# Altium schematic sheet Sheet1.SchDoc
size 330 x 215 mm
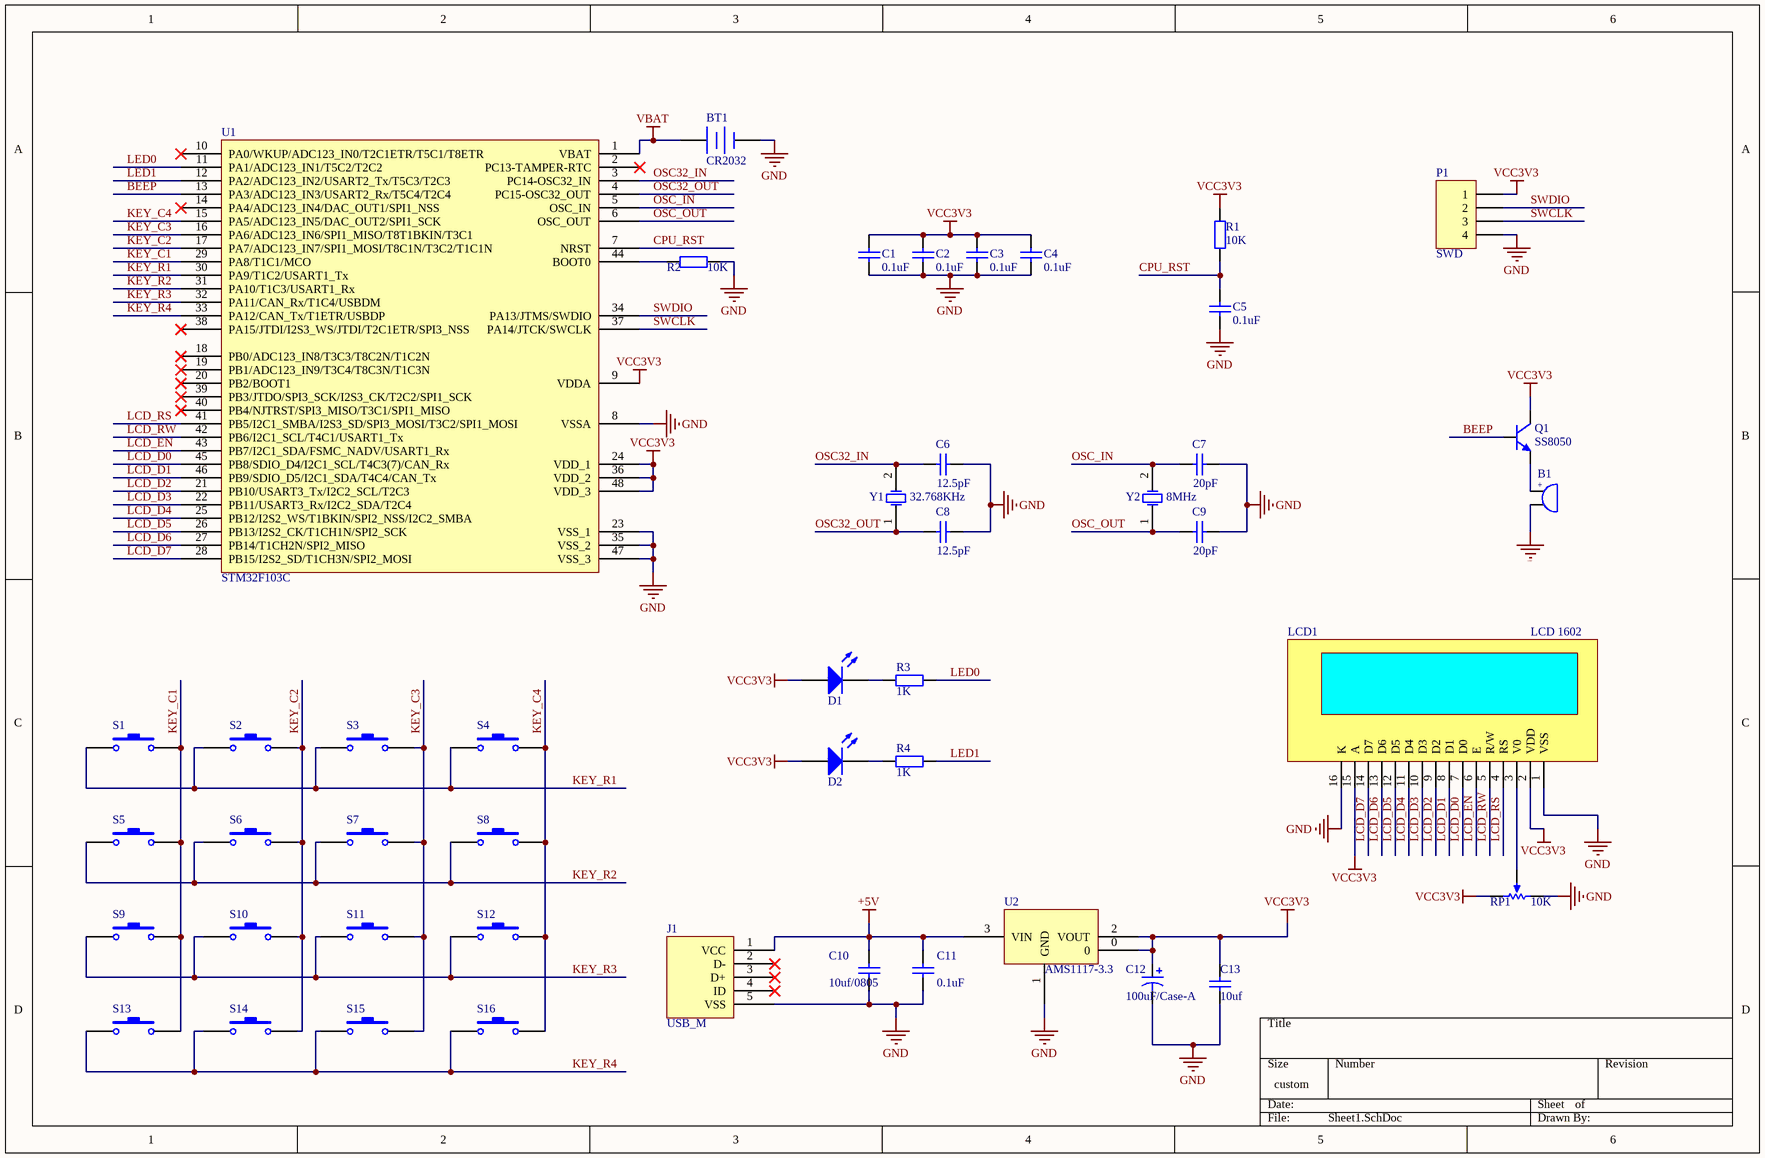
[diagram p0: Sheet1.SchDoc]

## Parts
B1  (no value)  [Beep]
BT1  CR2032  [CR1220]
C1  0.1uF  [C-RAD-0805]
C2  0.1uF  [C-RAD-0805]
C3  0.1uF  [C-RAD-0805]
C4  0.1uF  [C-RAD-0805]
C5  0.1uF  [C-RAD-0805]
C6  12.5pF  [C-RAD-0805]
C7  20pF  [C-RAD-0805]
C8  12.5pF  [C-RAD-0805]
C9  20pF  [C-RAD-0805]
C10  value 10uf/0805  [C-RAD-0805]  (hidden comment: Cap)
C11  value 0.1uF  [C-RAD-0805]  (hidden comment: Cap)
C12  value 100uF/Case-A  [CAP-3216]  (hidden comment: Cap Pol3)
C13  value 10uf  [C-RAD-0805]  (hidden comment: Cap)
D1  LED0  [LED_A2]  (value not drawn)
D2  LED0  [LED_A2]  (value not drawn)
J1  USB_M  [USB_MICRO]
LCD1  LCD 1602  [LCD-1602-ok]
P1  SWD  [HDR1X4]
Q1  SS8050  [SOT-23]
R1  10K  [0805-1]
R2  10K  [0805-1]
R3  1K  [0805-1]
R4  1K  [0805-1]
RP1  value 10K  [VR_A1]  (hidden comment: RPot)
S1  (no value)  [SW_PB2_A1]
S2  (no value)  [SW_PB2_A1]
S3  (no value)  [SW_PB2_A1]
S4  (no value)  [SW_PB2_A1]
S5  (no value)  [SW_PB2_A1]
S6  (no value)  [SW_PB2_A1]
S7  (no value)  [SW_PB2_A1]
S8  (no value)  [SW_PB2_A1]
S9  (no value)  [SW_PB2_A1]
S10  (no value)  [SW_PB2_A1]
S11  (no value)  [SW_PB2_A1]
S12  (no value)  [SW_PB2_A1]
S13  (no value)  [SW_PB2_A1]
S14  (no value)  [SW_PB2_A1]
S15  (no value)  [SW_PB2_A1]
S16  (no value)  [SW_PB2_A1]
U1  STM32F103C  [LQFP-48_M]
U2  AMS1117-3.3  [SOT-223]
Y1  32.768KHz  [X-TC15]
Y2  8MHz  [X-HC49U]

## Nets
+5V: C10.2 C11.2 J1.1(VCC) U2.3(VIN)
GND: B1.2 BT1.2(-) C1.2 C2.2 C3.2 C4.2 C5.1 C6.2 C7.2 C8.2 C9.2 C10.1 C11.1 C12.2 C13.1 J1.5(VSS) LCD1.1(VSS) LCD1.16(K) P1.4 R2.2 RP1.1(TOP) U1.8(VSSA) U1.23(VSS_1) U1.35(VSS_2) U1.47(VSS_3) U2.1(GND)
VBAT: BT1.1(+) U1.1(VBAT)
VCC3V3: C1.1 C2.1 C3.1 C4.1 C12.1 C13.2 D1.1(A) D2.1(A) LCD1.2(VDD) LCD1.15(A) P1.1 Q1.3(C) R1.1 RP1.3(BOT) U1.9(VDDA) U1.24(VDD_1) U1.36(VDD_2) U1.48(VDD_3) U2.0 U2.2(VOUT)
BEEP: Q1.2(B) U1.13(PA3/ADC123_IN3/USART2_Rx/T5C4/T2C4)
CPU_RST: C5.2 R1.2 U1.7(NRST)
KEY_C1: S1.2 S5.2 S9.2 S13.2 U1.29(PA8/T1C1/MCO)
KEY_C2: S2.2 S6.2 S10.2 S14.2 U1.17(PA7/ADC123_IN7/SPI1_MOSI/T8C1N/T3C2/T1C1N)
KEY_C3: S3.2 S7.2 S11.2 S15.2 U1.16(PA6/ADC123_IN6/SPI1_MISO/T8T1BKIN/T3C1)
KEY_C4: S4.2 S8.2 S12.2 S16.2 U1.15(PA5/ADC123_IN5/DAC_OUT2/SPI1_SCK)
KEY_R1: S1.1 S2.1 S3.1 S4.1 U1.30(PA9/T1C2/USART1_Tx)
KEY_R2: S5.1 S6.1 S7.1 S8.1 U1.31(PA10/T1C3/USART1_Rx)
KEY_R3: S9.1 S10.1 S11.1 S12.1 U1.32(PA11/CAN_Rx/T1C4/USBDM)
KEY_R4: S13.1 S14.1 S15.1 S16.1 U1.33(PA12/CAN_Tx/T1ETR/USBDP)
LCD_D0: LCD1.7(D0) U1.45(PB8/SDIO_D4/I2C1_SCL/T4C3(7)/CAN_Rx)
LCD_D1: LCD1.8(D1) U1.46(PB9/SDIO_D5/I2C1_SDA/T4C4/CAN_Tx)
LCD_D2: LCD1.9(D2) U1.21(PB10/USART3_Tx/I2C2_SCL/T2C3)
LCD_D3: LCD1.10(D3) U1.22(PB11/USART3_Rx/I2C2_SDA/T2C4)
LCD_D4: LCD1.11(D4) U1.25(PB12/I2S2_WS/T1BKIN/SPI2_NSS/I2C2_SMBA)
LCD_D5: LCD1.12(D5) U1.26(PB13/I2S2_CK/T1CH1N/SPI2_SCK)
LCD_D6: LCD1.13(D6) U1.27(PB14/T1CH2N/SPI2_MISO)
LCD_D7: LCD1.14(D7) U1.28(PB15/I2S2_SD/T1CH3N/SPI2_MOSI)
LCD_EN: LCD1.6(E) U1.43(PB7/I2C1_SDA/FSMC_NADV/USART1_Rx)
LCD_RS: LCD1.4(RS) U1.41(PB5/I2C1_SMBA/I2S3_SD/SPI3_MOSI/T3C2/SPI1_MOSI)
LCD_RW: LCD1.5(R/W) U1.42(PB6/I2C1_SCL/T4C1/USART1_Tx)
LED0: R3.1 U1.11(PA1/ADC123_IN1/T5C2/T2C2)
LED1: R4.1 U1.12(PA2/ADC123_IN2/USART2_Tx/T5C3/T2C3)
OSC32_IN: C6.1 U1.3(PC14-OSC32_IN) Y1.2(OSC2)
OSC32_OUT: C8.1 U1.4(PC15-OSC32_OUT) Y1.1(OSC1)
OSC_IN: C7.1 U1.5(OSC_IN) Y2.2(OSC2)
OSC_OUT: C9.1 U1.6(OSC_OUT) Y2.1(OSC1)
SWCLK: P1.3 U1.37(PA14/JTCK/SWCLK)
SWDIO: P1.2 U1.34(PA13/JTMS/SWDIO)
NetB1_1: B1.1 Q1.1(E)
NetD1_2: D1.2(K) R3.2
NetD2_2: D2.2(K) R4.2
NetLCD1_3: LCD1.3(V0) RP1.2(TAP)
NetR2_1: R2.1 U1.44(BOOT0)

Not connected (* = marked no-connect by the designer): J1 2(D-)* 3(D+)* 4(ID)*; U1 2(PC13-TAMPER-RTC)* 10(PA0/WKUP/ADC123_IN0/T2C1ETR/T5C1/T8ETR)* 14(PA4/ADC123_IN4/DAC_OUT1/SPI1_NSS)* 18(PB0/ADC123_IN8/T3C3/T8C2N/T1C2N)* 19(PB1/ADC123_IN9/T3C4/T8C3N/T1C3N)* 20(PB2/BOOT1)* 38(PA15/JTDI/I2S3_WS/JTDI/T2C1ETR/SPI3_NSS)* 39(PB3/JTDO/SPI3_SCK/I2S3_CK/T2C2/SPI1_SCK)* 40(PB4/NJTRST/SPI3_MISO/T3C1/SPI1_MISO)*

## Notes on the sheet
- (in symbol BEEP) +

## Library data of the parts
B1 = BEEP: 蜂鸣器; 版权归属: 源创客; BOM名称: 蜂鸣器; 学习资源: www.ooocke.com
BT1 = Battery: 备份电池; Published: 24-Mar-1999; LatestRevisionDate: 17-Jul-2002; LatestRevisionNote: Re-released for DXP Platform.; PackageReference: BAT-2; Publisher: Altium Limited
C1-C4 = CAP: Capacitor; Value: 100nF; Published: 8-Jun-2000; Revision: July-2002: Re-released for DXP Platform.; Publisher: Altium Limited
C5-C9 = Cap: 无极性电容; Value: 100nF; Published: 8-Jun-2000; LatestRevisionDate: 17-Jul-2002; LatestRevisionNote: Re-released for DXP Platform.; PackageReference: RAD-0.3; Publisher: Altium Limited
C10 C11 C13 = Cap: Capacitor; Published: 8-Jun-2000; LatestRevisionDate: 17-Jul-2002; LatestRevisionNote: Re-released for DXP Platform.; PackageReference: RAD-0.3; Publisher: Altium Limited; PackageDescription: Radial Cap, Thru-Hole; 2 Leads; 0.3 in Pin Spacing
C12 = Cap Pol3: Polarized Capacitor (Surface Mount); Published: 8-Jun-2000; LatestRevisionDate: 29-May-2009; LatestRevisionNote: IPC-7351 Footprint Added.; PackageReference: C0805; Publisher: Altium Limited; PackageDescription: Chip Capacitor
D1 D2 = LED0: 发光二极管; Published: 8-Jun-2000; LatestRevisionDate: 08-Jul-2005; LatestRevisionNote: Mech Layer 1 removed.; PackageReference: LED-0; Publisher: Altium Limited
J1 = USB_M: MicroUSB接口
LCD1 = LCD 1602: 版权归属: 源创客; BOM名称: LCD 1602; 学习资源: www.ooocke.com
P1 = Header 4H: Header, 4-Pin, Right Angle; LatestRevisionDate: 17-Jul-2002; LatestRevisionNote: Re-released for DXP Platform.; Publisher: Altium Limited
Q1 = 8050-DIP: 高频放大-NPN型; 版权归属: 源创客; 属性: 40V 1.5A 1W 100MHZ; BOM名称: 高频放大-NPN型; 学习资源: www.ooocke.com
R1-R4 = Res2: Resistor; Published: 8-Jun-2000; LatestRevisionDate: 17-Jul-2002; LatestRevisionNote: Re-released for DXP Platform.; PackageReference: AXIAL-0.4; Publisher: Altium Limited
RP1 = RPot: 精密可调电阻; Sim Note: Enter the Resistance value and the set point into parameter fields.; Set Position: 0.5; Published: 8-Jun-2000; LatestRevisionDate: 17-Jul-2002; LatestRevisionNote: Re-released for DXP Platform.; PackageReference: VR5; Publisher: Altium Limited
S1-S16 = SW-PB: 微动开关; Published: 24-Mar-1999; LatestRevisionDate: 17-Jul-2002; LatestRevisionNote: Re-released for DXP Platform.; PackageReference: SPST-2; Publisher: Altium Limited
U1 = STM32F103C: STM32单片机48引脚
Y1 = SMD-3215_2P 32.768KHz 20ppm 12.5pF: 贴片晶振; ComponentLink1Description: 供应商链接; ComponentLink1URL: http://www.szlcsc.com/product/details_33310.html; Package: SMD-3215_2P; Supplier: LC; SuppliersPartNumber: C32346
Y2 = SMD-5032_2P 8MHz 20ppm 20pF: 贴片晶振; ComponentLink1Description: 供应商链接; ComponentLink1URL: http://www.szlcsc.com/product/details_19261.html; Package: SMD-5032_2P; Supplier: LC; SuppliersPartNumber: C18560